# EAGLE design secondary_18 (EAGLE 8.6.0)
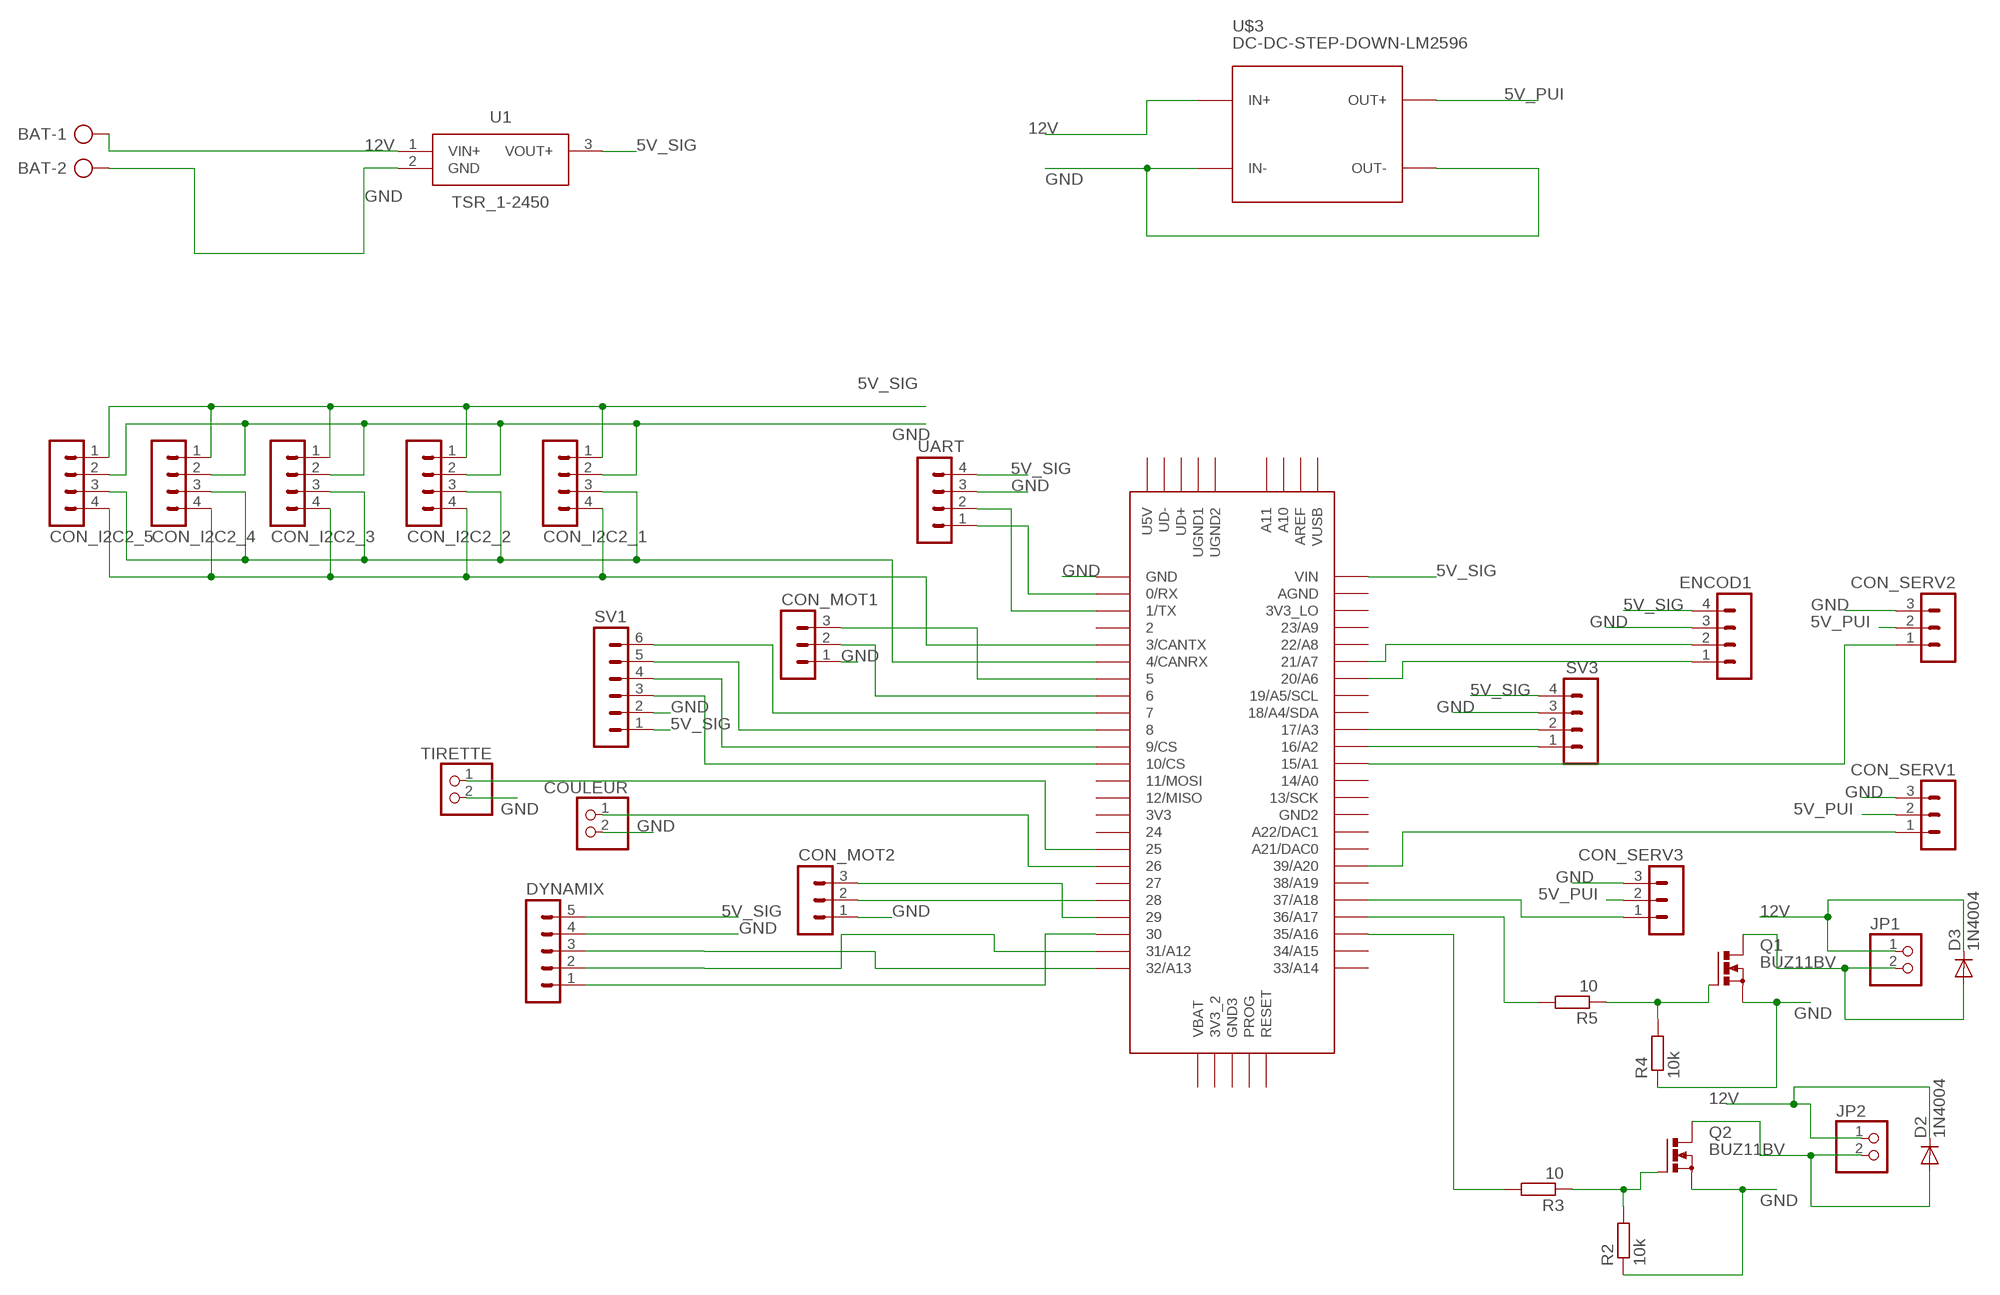
[diagram p0: schematic, sheet 1]

## Parts
BAT  AK300/2  [AK300/2]
CON_I2C2_1  MA04-1  [MA04-1]
CON_I2C2_2  MA04-1  [MA04-1]
CON_I2C2_3  MA04-1  [MA04-1]
CON_I2C2_4  MA04-1  [MA04-1]
CON_I2C2_5  MA04-1  [MA04-1]
CON_MOT1  MA03-1  [MA03-1]
CON_MOT2  MA03-1  [MA03-1]
CON_SERV1  MA03-1  [MA03-1]
CON_SERV2  MA03-1  [MA03-1]
CON_SERV3  MA03-1  [MA03-1]
COULEUR  PINHD-1X2  [1X02]
D2  1N4004  [DO41-10]
D3  1N4004  [DO41-10]
DYNAMIX  MA05-1  [MA05-1]
ENCOD1  MA04-1  [MA04-1]
JP1  PINHD-1X2  [1X02]
JP2  PINHD-1X2  [1X02]
Q1  BUZ11BV  [TO220BV]
Q2  BUZ11BV  [TO220BV]
R2  10k  R-EU_0204/7  [0204/7]
R3  10  R-EU_0204/7  [0204/7]
R4  10k  R-EU_0204/7  [0204/7]
R5  10  R-EU_0204/7  [0204/7]
SV1  MA06-1  [MA06-1]
SV3  MA04-1  [MA04-1]
TIRETTE  PINHD-1X2  [1X02]
U1  TSR_1-2450  [TSR-1-24120]
U$1  TEENSY_3.5/3.6  [TEENSY_3.5/3.6]
U$3  DC-DC-STEP-DOWN-LM2596  [DC-DC-STEP-DOWN-LM2596]
UART  MA04-1  [MA04-1]

## Nets
5V_PUI: CON_SERV1.2 CON_SERV2.2 CON_SERV3.2 U$3.OUT+
5V_SIG: CON_I2C2_1.1 CON_I2C2_2.1 CON_I2C2_3.1 CON_I2C2_4.1 CON_I2C2_5.1 DYNAMIX.5 ENCOD1.4 SV1.1 SV3.4 U1.3(VOUT+) U$1.VIN UART.4
12V: BAT.1 D2.C D3.C JP1.1 JP2.1 U1.1(VIN+) U$3.IN+
GND: BAT.2 CON_I2C2_1.2 CON_I2C2_2.2 CON_I2C2_3.2 CON_I2C2_4.2 CON_I2C2_5.2 CON_MOT1.1 CON_MOT2.1 CON_SERV1.3 CON_SERV2.3 CON_SERV3.3 COULEUR.2 DYNAMIX.4 ENCOD1.3 Q1.S Q2.S R2.1 R4.1 SV1.2 SV3.3 TIRETTE.2 U1.2(GND) U$1.GND U$3.IN- U$3.OUT- UART.3
N$2: CON_MOT2.3 U$1.29
N$3: CON_MOT1.3 U$1.5
N$4: CON_MOT1.2 U$1.6
N$5: CON_MOT2.2 U$1.28
N$6: Q2.G R2.2 R3.1
N$7: R3.2 U$1.35/A16
N$8: D2.A JP2.2 Q2.D
N$9: SV3.1 U$1.16/A2
N$10: Q1.G R4.2 R5.1
N$11: R5.2 U$1.36/A17
N$12: D3.A JP1.2 Q1.D
N$13: SV3.2 U$1.17/A3
N$14: ENCOD1.1 U$1.20/A6
N$15: ENCOD1.2 U$1.21/A7
N$16: CON_SERV2.1 U$1.15/A1
N$17: CON_SERV3.1 U$1.37/A18
N$18: DYNAMIX.3 U$1.32/A13
N$19: CON_SERV1.1 U$1.39/A20
N$20: DYNAMIX.2 U$1.31/A12
N$21: CON_I2C2_1.4 CON_I2C2_2.4 CON_I2C2_3.4 CON_I2C2_4.4 CON_I2C2_5.4 U$1.3/CANTX
N$22: COULEUR.1 U$1.26
N$23: CON_I2C2_1.3 CON_I2C2_2.3 CON_I2C2_3.3 CON_I2C2_4.3 CON_I2C2_5.3 U$1.4/CANRX
N$24: DYNAMIX.1 U$1.30
N$25: TIRETTE.1 U$1.25
N$26: U$1.1/TX UART.2
N$27: U$1.0/RX UART.1
N$30: SV1.3 U$1.10/CS
N$31: SV1.4 U$1.9/CS
N$32: SV1.5 U$1.8
N$33: SV1.6 U$1.7
Unconnected: U$1.2 U$1.3V3 U$1.3V3_2 U$1.3V3_LO U$1.11/MOSI U$1.12/MISO U$1.13/SCK U$1.14/A0 U$1.18/A4/SDA U$1.19/A5/SCL U$1.21/DAC0(A21/DAC0) U$1.22/A8 U$1.23/A9 U$1.24 U$1.27 U$1.33/A14 U$1.34/A15 U$1.38/A19 U$1.A10 U$1.A11 U$1.A22/DAC1 U$1.AGND U$1.AREF U$1.GND2 U$1.GND3 U$1.PROG U$1.RESET U$1.U5V U$1.UD+ U$1.UD- U$1.UGND1 U$1.UGND2 U$1.VBAT U$1.VUSB

## Library data of the parts
BAT = con-ptr500:AK300/2: CONNECTOR; OC_FARNELL: unknown; OC_NEWARK: unknown
CON_I2C2_1-CON_I2C2_5 ENCOD1 SV3 UART = con-lstb:MA04-1: PIN HEADER; OC_FARNELL: unknown; OC_NEWARK: unknown
CON_MOT1 CON_MOT2 CON_SERV1-CON_SERV3 = con-lstb:MA03-1: PIN HEADER; OC_FARNELL: unknown; OC_NEWARK: unknown
COULEUR JP1 JP2 TIRETTE = pinhead:PINHD-1X2: PIN HEADER
D2 D3 = diode:1N4004: DIODE general purpose rectifier, 1 A
DYNAMIX = con-lstb:MA05-1: PIN HEADER; OC_FARNELL: unknown; OC_NEWARK: unknown
Q1 Q2 = transistor-power:BUZ11: N-CHANNEL MOS FET
R2-R5 = resistor:R-EU_: RESISTOR, European symbol
SV1 = con-lstb:MA06-1: PIN HEADER; OC_FARNELL: unknown; OC_NEWARK: unknown
U1 = SamacSys_Parts:TSR_1-2450: Switching Regulator,6.5-32Vin,5Vout 1A Switching Regulator, 6.5 ??? 36V dc Input, 5V Output, 1A <https://componentsearchengine.com/Images/1/TSR+1-2450.jpg> Source: Datasheet <http://assets.tracopower.com/20160301160144/TSR1/documents/tsr1-datasheet.pdf>; DESCRIPTION: Switching Regulator,6.5-32Vin,5Vout 1A Switching Regulator, 6.5 ??? 36V dc Input, 5V Output, 1A; HEIGHT: mm; MANUFACTURER_NAME: Traco Power; MANUFACTURER_PART_NUMBER: TSR 1-2450; RS_PART_NUMBER: 6664379P; SUPPLIER_NAME: RS
U$1 = Teensy356:TEENSY_3.5/3.6
U$3 = diy-modules:DC-DC-STEP-DOWN-LM2596: DC/DC Step-Down Regulator based on LM2596-ADJ chip LM2596 datasheet available here: http://www.ti.com/lit/ds/symlink/lm2596.pdf Click here to find device on ebay.com <http://www.ebay.com/sch/lm2596+power+regulator>

## Board
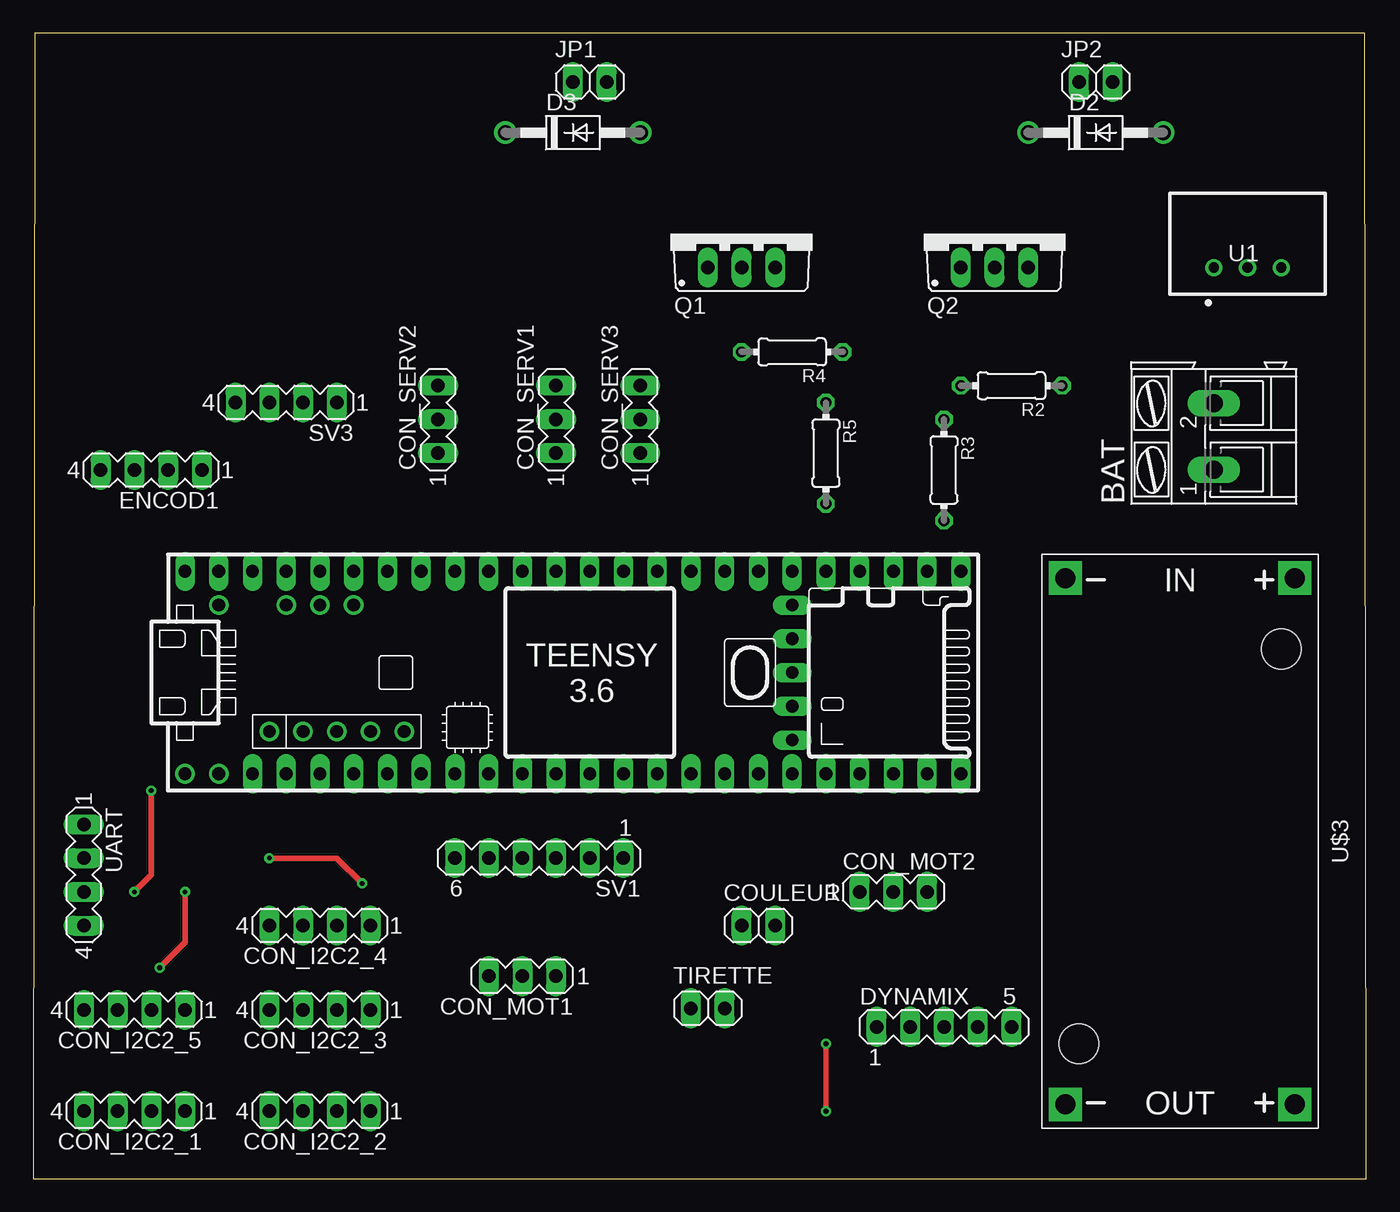
[diagram p1: board, top side]
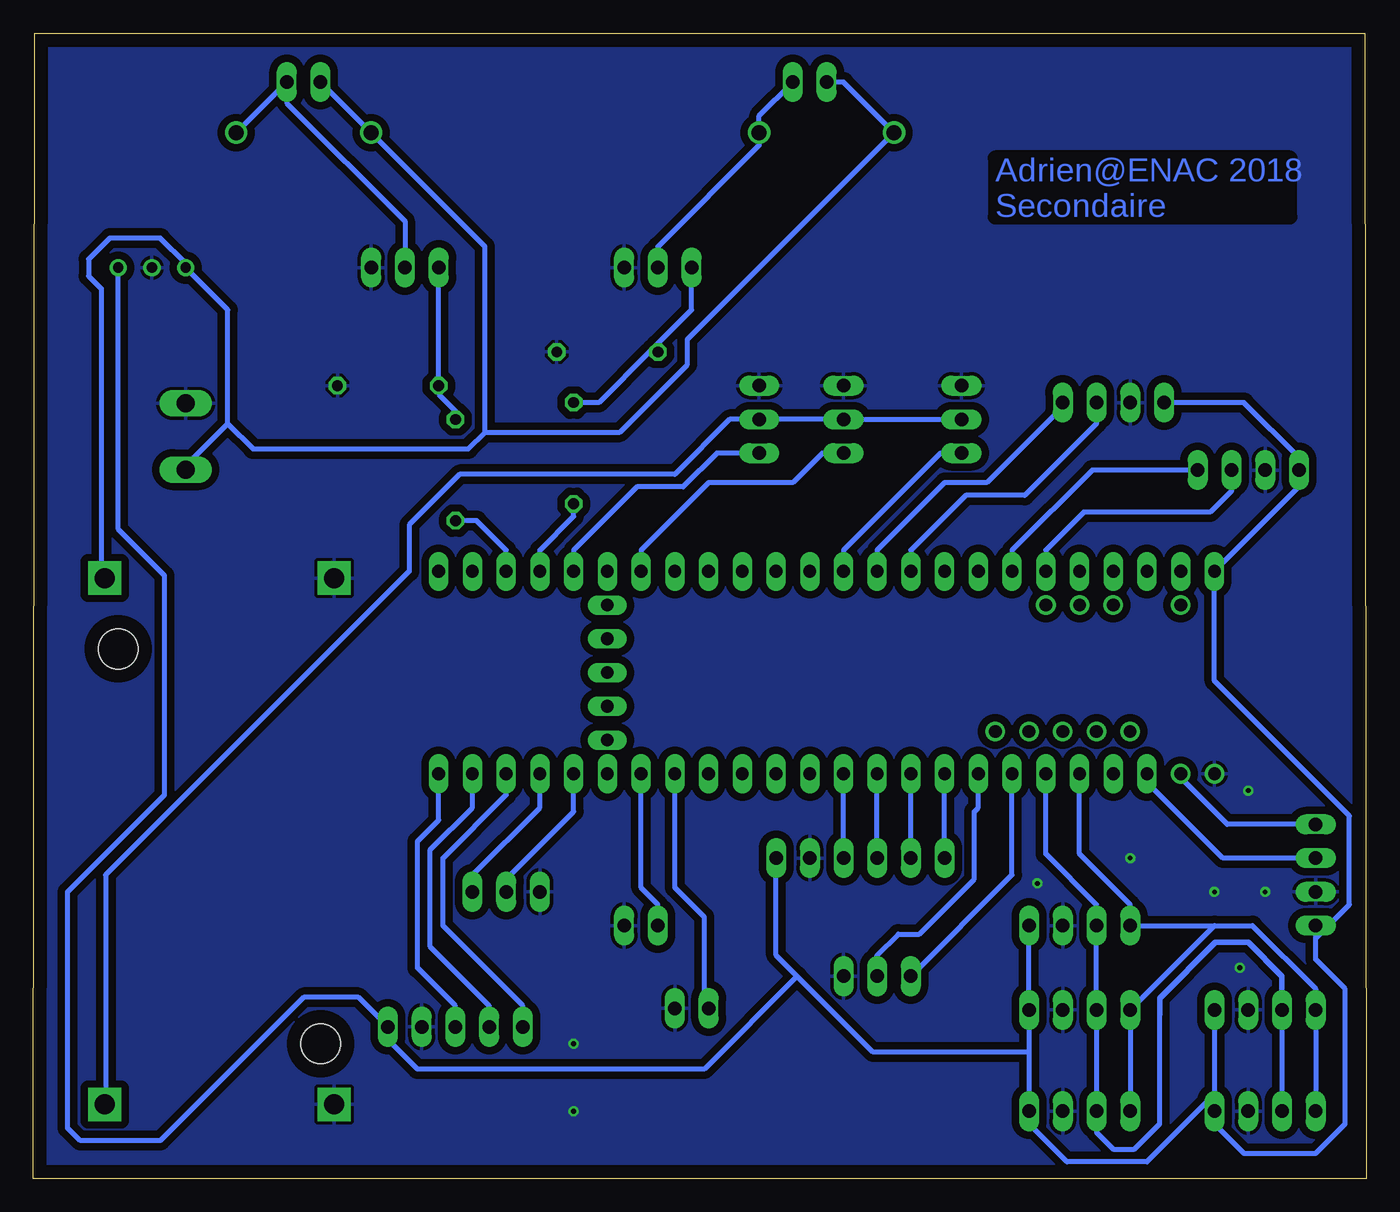
[diagram p2: board, bottom side, seen from below]

Size 100.38 x 86.22 mm. Coordinates in mm from the lower left corner, seen from the top.
Outline: 0,0 100.38,0 100.25,86.22 0.13,86.22 0,0
Copper layers (1*16): Top 0.035mm / dielectric 1.5mm / Bottom 0.035mm
Design rules "base *": minimum track width 15mil, minimum drill 0.35mm, track to track 22mil, track to pad 22mil, pad to pad 22mil, via to via 6mil, smd to smd 6mil, copper to edge 40mil, drill to drill 6mil, minimum pad ring 10mil, minimum via ring 8mil, stop-mask expansion 4mil, vias tented up to drill 0mil, thermal gap 10mil

### Footprints (pad centres in the part's own frame; a part is rotated, then mirrored left to right if it is on the bottom)
AK300/2 = drill 1.321 long: 1 -2.515,0; 2 2.489,0
MA04-1 = drill 1.016 long: 1 -3.81,0; 2 -1.27,0; 3 1.27,0; 4 3.81,0
MA03-1 = drill 1.016 long: 1 -2.54,0; 2 0,0; 3 2.54,0
1X02 = drill 1.016 long: 1 -1.27,0; 2 1.27,0
DO41-10 = drill 1.118: A 5.08,0; C -5.08,0
MA05-1 = drill 1.016 long: 1 -5.08,0; 2 -2.54,0; 3 0,0; 4 2.54,0; 5 5.08,0
TO220BV = drill 1.016 long: D 0,-2.54; G -2.54,-2.54; S 2.54,-2.54
0204/7 = drill 0.813 octagon: 1 -3.81,0; 2 3.81,0
MA06-1 = drill 1.016 long: 1 -6.35,0; 2 -3.81,0; 3 -1.27,0; 4 1.27,0; 5 3.81,0; 6 6.35,0
TSR-1-24120 = drill 0.78 pad 1.28: 1 -2.54,0; 2 0,0; 3 2.54,0
TEENSY_3.5/3.6 = drill 0.965 pad 1.422: 0/RX -25.4,-7.62; A10 -17.78,5.08; A11 -15.24,5.08; AREF -20.32,5.08; GND -27.94,-7.62; U5V -21.59,-4.445; UD+ -16.51,-4.445; UD- -19.05,-4.445; UGND1 -13.97,-4.445; UGND2 -11.43,-4.445; VUSB -25.4,5.08 | drill 0.965 pad 1.27 long: 1/TX -22.86,-7.62; 2 -20.32,-7.62; 3/CANTX -17.78,-7.62; 3V3 7.62,-7.62; 3V3_LO -22.86,7.62; 4/CANRX -15.24,-7.62; 5 -12.7,-7.62; 6 -10.16,-7.62; 7 -7.62,-7.62; 8 -5.08,-7.62; 9/CS -2.54,-7.62; 10/CS 0,-7.62; 11/MOSI 2.54,-7.62; 12/MISO 5.08,-7.62; 13/SCK 5.08,7.62; 14/A0 2.54,7.62; 15/A1 0,7.62; 16/A2 -2.54,7.62; 17/A3 -5.08,7.62; 18/A4/SDA -7.62,7.62; 19/A5/SCL -10.16,7.62; 20/A6 -12.7,7.62; 21/A7 -15.24,7.62; 21/DAC0 12.7,7.62; 22/A8 -17.78,7.62; 23/A9 -20.32,7.62; 24 10.16,-7.62; 25 12.7,-7.62; 26 15.24,-7.62; 27 17.78,-7.62; 28 20.32,-7.62; 29 22.86,-7.62; 30 25.4,-7.62; 31/A12 27.94,-7.62; 32/A13 30.48,-7.62; 33/A14 30.48,7.62; 34/A15 27.94,7.62; 35/A16 25.4,7.62; 36/A17 22.86,7.62; 37/A18 20.32,7.62; 38/A19 17.78,7.62; 39/A20 15.24,7.62; A22/DAC1 10.16,7.62; AGND -25.4,7.62; GND2 7.62,7.62; RESET 17.78,5.08; VBAT 17.78,-5.08; VIN -27.94,7.62 | drill 0.965 long: 3V3_2 17.78,-2.54; GND3 17.78,0; PROG 17.78,2.54
DC-DC-STEP-DOWN-LM2596 = drill 1.5 pad 2.5 square: IN+ -19.812,8.636; IN- -19.812,-8.636; OUT+ 19.812,8.636; OUT- 19.812,-8.636 | hole 3: -14.478,7.62; 15.24,-7.62

### Placement (x,y rotation side)
BAT  88.9,55.88 90 top
CON_I2C2_1  7.62,5.08 180 top
CON_I2C2_2  21.59,5.08 180 top
CON_I2C2_3  21.59,12.7 180 top
CON_I2C2_4  21.59,19.05 180 top
CON_I2C2_5  7.62,12.7 180 top
CON_MOT1  36.83,15.24 180 top
CON_MOT2  64.77,21.59 0 top
CON_SERV1  39.37,57.15 90 top
CON_SERV2  30.48,57.15 90 top
CON_SERV3  45.72,57.15 90 top
COULEUR  54.61,19.05 0 top
D2  80.01,78.74 0 top
D3  40.64,78.74 0 top
DYNAMIX  68.58,11.43 0 top
ENCOD1  8.89,53.34 180 top
JP1  41.91,82.55 0 top
JP2  80.01,82.55 0 top
Q1  53.34,71.12 0 top
Q2  72.39,71.12 0 top
R2  73.66,59.69 180 top
R3  68.58,53.34 270 top
R4  57.15,62.23 180 top
R5  59.69,54.61 270 top
SV1  38.1,24.13 180 top
SV3  19.05,58.42 180 top
TIRETTE  50.8,12.83 0 top
U1  91.44,68.58 0 top
U$1  39.37,38.1 0 top
U$3  86.36,25.4 270 top
UART  3.81,22.86 270 top

### Tracks (layer width: path | path; a pad name or v marks a point on that pad's centre or on a via)
5V_PUI
  Bottom 0.381: CON_SERV2.2 CON_SERV1.2 CON_SERV3.2 47.94,57.15 52.07,53.02 68.26,53.02 72.07,49.21 72.07,45.72 94.93,22.86 94.93,5.71 U$3.OUT+
5V_SIG
  Bottom 0.381: U1.3 93.98,48.9 90.49,45.4 90.49,28.89 97.79,21.59 97.79,3.81 96.84,2.86 90.81,2.86 80.01,13.65 75.88,13.65 DYNAMIX.5 73.66,10.48 71.44,8.26 49.85,8.26 42.86,15.24 | 25.4,9.53 CON_I2C2_3.1 CON_I2C2_4.1 | 25.4,9.53 CON_I2C2_2.1 25.4,4.13 22.54,1.27 16.51,1.27 11.43,6.35 | SV1.1 44.45,16.83 42.86,15.24 | 42.86,15.24 37.15,9.53 25.4,9.53 | SV3.4 9.21,58.42 5.08,54.29 ENCOD1.4 5.08,52.07 U$1.VIN 11.43,37.47 1.27,27.3 1.27,20.64 3.81,18.1 | CON_I2C2_5.1 11.43,6.35 | 3.81,18.1 3.81,16.51 1.59,14.29 1.59,4.13 3.81,1.91 9.21,1.91 11.43,4.13 CON_I2C2_1.1 11.43,6.35 | 3.81,18.1 UART.4
12V
  Bottom 0.381: JP1.1 39.37,82.55 D3.C 51.12,63.18 51.12,61.28 56.2,56.2 66.36,56.2 | JP2.1 D2.C 66.36,70.17 66.36,56.2 | 85.72,56.83 85.72,65.41 U1.1 88.9,68.9 90.81,70.8 94.61,70.8 96.2,69.22 96.2,67.94 95.25,66.99 95.25,45.4 U$3.IN+ | 85.72,56.83 88.9,53.66 BAT.1 | 66.36,56.2 67.63,54.93 83.82,54.93 85.72,56.83
GND  (via drill 0.35)
  Top 0.406: v8.89,29.21 8.89,22.86 v7.62,21.59 | v11.43,21.59 11.43,17.78 v9.53,15.88 | v59.69,10.16 v59.69,5.08 | v17.78,24.13 22.86,24.13 v24.77,22.23
  pour Bottom: 0,0 100.33,0 100.33,86.36 0,86.36
N$2
  Bottom 0.381: U$1.29 62.23,27.94 67.31,22.86 CON_MOT2.3
N$3
  Bottom 0.381: U$1.5 26.67,22.86 CON_MOT1.3
N$4
  Bottom 0.381: U$1.6 29.21,27.94 29.53,27.62 29.53,22.54 33.66,18.41 35.24,18.41 36.83,16.83 CON_MOT1.2
N$5
  Bottom 0.381: U$1.28 59.69,27.62 64.77,22.54 CON_MOT2.2
N$6
  Bottom 0.381: R3.1 68.58,57.78 69.85,59.05 R2.2 Q2.G
N$7
  Bottom 0.381: R3.2 66.99,49.53 64.77,47.31 U$1.35/A16
N$8
  Bottom 0.381: Q2.D 72.39,72.07 81.28,80.96 JP2.2 D2.A
N$9
  Bottom 0.381: U$1.16/A2 36.83,47.31 31.75,52.39 28.57,52.39 22.86,58.1 SV3.1
N$10
  Bottom 0.381: R5.1 57.78,58.42 53.98,62.23 | Q1.G 50.8,65.41 53.98,62.23 | 53.98,62.23 R4.2
N$11
  Bottom 0.381: R5.2 59.69,49.85 62.23,47.31 U$1.36/A17
N$12
  Bottom 0.381: Q1.D 53.34,70.17 45.72,77.79 D3.A 45.72,80.01 JP1.2
N$13
  Bottom 0.381: U$1.17/A3 34.29,47.31 30.16,51.44 25.72,51.44 20.32,56.83 SV3.2
N$14
  Bottom 0.381: U$1.20/A6 26.67,47.31 20.64,53.34 ENCOD1.1
N$15
  Bottom 0.381: U$1.21/A7 24.13,47.31 21.27,50.16 11.75,50.16 10.16,51.75 ENCOD1.2
N$16
  Bottom 0.381: U$1.15/A1 39.37,47.31 32.07,54.61 CON_SERV2.1
N$17
  Bottom 0.381: U$1.37/A18 59.69,47.31 54.93,52.07 51.44,52.07 48.9,54.61 CON_SERV3.1
N$18
  Bottom 0.381: U$1.32/A13 69.85,26.99 71.44,25.4 71.44,15.88 68.58,13.02 DYNAMIX.3
N$19
  Bottom 0.381: U$1.39/A20 54.61,47.31 49.53,52.39 43.18,52.39 40.96,54.61 CON_SERV1.1
N$20
  Bottom 0.381: U$1.31/A12 67.31,27.94 70.48,24.77 70.48,17.46 66.04,13.02 DYNAMIX.2
N$21
  Bottom 0.381: CON_I2C2_2.4 CON_I2C2_3.4 11.43,19.05 | CON_I2C2_1.4 CON_I2C2_5.4 3.81,14.29 8.57,19.05 11.43,19.05 | U$1.3/CANTX 21.59,24.45 17.78,20.64 CON_I2C2_4.4 11.43,19.05
N$22
  Bottom 0.381: U$1.26 54.61,21.91 53.34,20.64 COULEUR.1
N$23
  Bottom 0.381: U$1.4/CANRX 24.13,24.45 20.32,20.64 CON_I2C2_4.3 CON_I2C2_3.3 CON_I2C2_2.3 20.32,3.49 19.05,2.22 17.46,2.22 15.56,4.13 15.56,12.38 | CON_I2C2_1.3 CON_I2C2_5.3 6.35,13.65
  Bottom 0.406: 15.56,12.38 15.56,13.57 11.35,17.78 8.89,17.78 6.35,15.24 CON_I2C2_5.3
N$24
  Bottom 0.381: U$1.30 64.77,28.89 69.53,24.13 69.53,19.05 63.5,13.02 DYNAMIX.1
N$25
  Bottom 0.381: U$1.25 52.07,21.91 49.85,19.68 49.85,13.34 49.53,13.02 TIRETTE.1
N$26
  Bottom 0.381: U$1.1/TX 16.51,29.84 10.79,24.13 UART.2
N$27
  Bottom 0.381: U$1.0/RX 13.97,30.16 10.48,26.67 UART.1
N$30
  Bottom 0.381: SV1.3 U$1.10/CS
N$31
  Bottom 0.381: SV1.4 U$1.9/CS
N$32
  Bottom 0.381: SV1.5 U$1.8
N$33
  Bottom 0.381: SV1.6 U$1.7

### Text on the board
Bottom: Adrien@ENAC 2018 / Secondaire